# Altium schematic sheet sensors.SchDoc: Ap_Det_Sensors
size A; Revision: 1.2; SheetNumber: 2; SheetTotal: 2
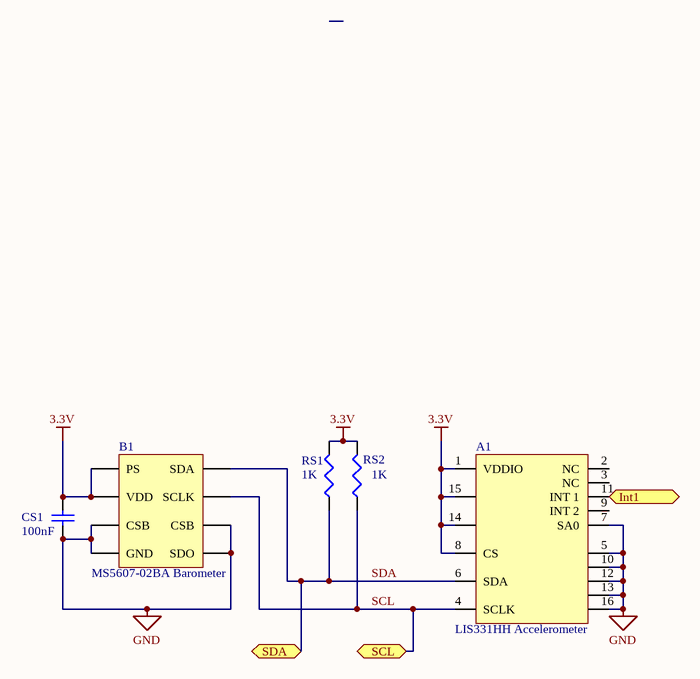
[diagram p0: sensors.SchDoc]

## Parts
A1  LIS331HH Accelerometer  [LGA16]
B1  MS5607-02BA Barometer  [Barometer LCC]
CS1  value 100nF  [C1206]  (hidden comment: Cap Semi)
RS1  value 1K  [J1-0603]  (hidden comment: Res3)
RS2  value 1K  [J1-0603]  (hidden comment: Res3)

## Ports
Int1, SCL, SDA

## Nets
3.3V: A1.1(VDDIO) A1.8(CS) A1.14 A1.15 B1.1(VDD) B1.2(PS) CS1.2 RS1.2 RS2.2
GND: A1.5(GND) A1.7(SA0) A1.10 A1.12 A1.13 A1.16 B1.3(GND) B1.4(CSB) B1.5(CSB) B1.6(SDO) CS1.1
Int1: A1.11(INT_1) ; port Int1
SCL: A1.4(SCLK) B1.8(SCLK) RS2.1 ; port SCL
SDA: A1.6(SDA) B1.7(SDA) RS1.1 ; port SDA

Not connected (* = marked no-connect by the designer): A1 2(NC) 3(NC) 9(INT_2)

## Library data of the parts
CS1 = Cap Semi: Capacitor (Semiconductor SIM Model); Published: 8-Jun-2000; LatestRevisionDate: 29-May-2009; LatestRevisionNote: IPC-7351 Footprint Added.; PackageReference: C1206; Publisher: Altium Limited; PackageDescription: Chip Capacitor
RS1 RS2 = Res3: Resistor; Published: 8-Jun-2000; LatestRevisionDate: 29-May-2009; LatestRevisionNote: IPC-7351 Footprint Added.; PackageReference: J1-0603; Publisher: Altium Limited; PackageDescription: Chip Resistor